# EAGLE design BMX280_breakout (EAGLE 7.4.0)
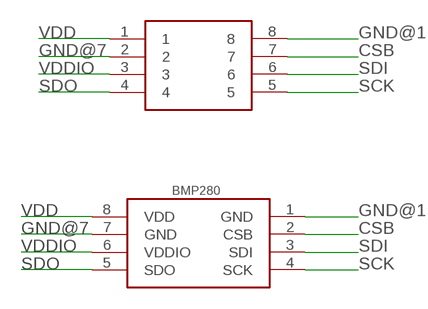
[diagram p0: schematic, sheet 1]

## Parts
BMP280  BO-BMP280  [BOSCH-BMP280]
U$1  8PIN  [8PIN]

## Nets
CSB: BMP280.2(CSB) U$1.7
GND@1: BMP280.1(GND) U$1.8
GND@7: BMP280.7(GND) U$1.2
SCK: BMP280.4(SCK) U$1.5
SDI: BMP280.3(SDI) U$1.6
SDO: BMP280.5(SDO) U$1.4
VDD: BMP280.8(VDD) U$1.1
VDDIO: BMP280.6(VDDIO) U$1.3

## Library data of the parts
BMP280 = FaBo-Mems:BO-BMP280
U$1 = FaBo-Breakout:8PIN

## Board
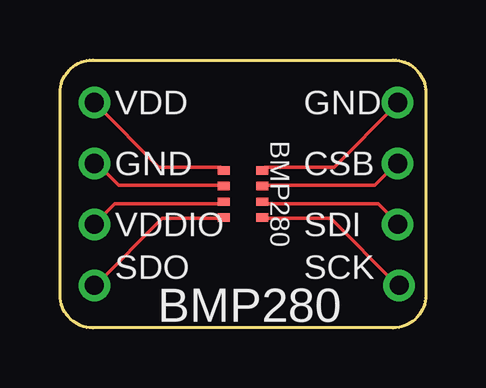
[diagram p1: board, top side]
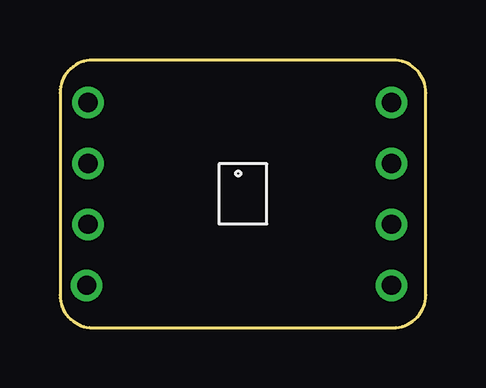
[diagram p2: board, bottom side, seen from below]

Size 15.24 x 11.16 mm. Coordinates in mm from the lower left corner, seen from the top.
Copper layers (1*16): Top 0.035mm / dielectric 1.5mm / Bottom 0.035mm
Design rules "SeeedStudio_2layer_DRU_no_angle_20140221": minimum track width 6mil, minimum drill 12mil, track to track 6mil, track to pad 6mil, pad to pad 6mil, via to via 6mil, smd to smd 0mil, copper to edge 10mil, drill to drill 10mil, minimum pad ring 10mil, minimum via ring 6mil, stop-mask expansion 2mil, vias tented up to drill 100mil, thermal gap 10mil

### Footprints (pad centres in the part's own frame; a part is rotated, then mirrored left to right if it is on the bottom)
BOSCH-BMP280 = smd 0.35 x 0.5: 1 -0.975,0.8; 2 -0.325,0.8; 3 0.325,0.8; 4 0.975,0.8; 5 0.975,-0.8; 6 0.325,-0.8; 7 -0.325,-0.8; 8 -0.975,-0.8
8PIN = drill 0.8: 1 -7.46,3.81; 2 -7.46,1.27; 3 -7.46,-1.27; 4 -7.46,-3.81; 5 5.24,-3.81; 6 5.18,-1.27; 7 5.18,1.27; 8 5.18,3.81

### Placement (x,y rotation side)
BMP280  7.62,5.58 270 top
U$1  8.89,5.58 0 top

### Tracks (layer width: path | path; a pad name or v marks a point on that pad's centre or on a via)
CSB
  Top 0.152: BMP280.2 8.53,5.94 13.11,5.94 14.02,6.85 U$1.7
GND@1
  Top 0.152: BMP280.1 8.53,6.7 11.43,6.7 14.02,9.29 U$1.8
GND@7
  Top 0.152: BMP280.7 6.71,5.94 2.44,5.94 1.52,6.85 U$1.2
SCK
  Top 0.152: BMP280.4 8.53,4.56 11.28,4.56 14.02,1.82 U$1.5
SDI
  Top 0.152: BMP280.3 8.53,5.17 13.26,5.17 14.02,4.41 U$1.6
SDO
  Top 0.152: BMP280.5 6.71,4.56 4.27,4.56 1.52,1.82 U$1.4
VDD
  Top 0.152: BMP280.8 6.71,6.7 4.12,6.7 1.52,9.29 U$1.1
VDDIO
  Top 0.152: BMP280.6 6.71,5.17 2.29,5.17 1.52,4.41 U$1.3

### Text on the board
tPlace: VDD | GND | GND | CSB | VDDIO | SDI | SDO | SCK | BMP280